# Altium schematic sheet SHDN-BSPD-S03-V00-VoltageDivider.SchDoc: Voltage Divider
size A3; DrawnBy: Jonn Dillon; DocumentNumber: 03; Revision: 01; SheetNumber: 03; SheetTotal: 12; Version: 00; PageSetup: Record=PageOptions|CenterHorizontal=True|CenterVertical=True|PrintScale=0.97|XCorrection=1.00|YCorrection=1.00|PrintKind=0|BorderSize=5000000|LeftOffset=0|BottomOffset=0|Orientation=2|PaperLength=1000|PaperWidth=1000|Scale=100|PaperSource=7|PrintQuality=-4|MediaType=1|DitherType=10|PaperKind=A4|PrintScaleMode=1
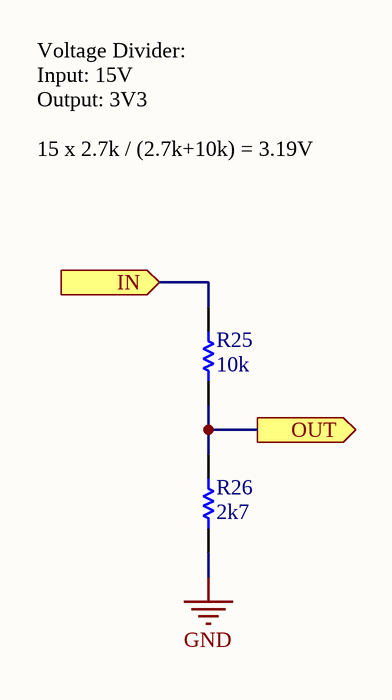
[diagram p0: SHDN-BSPD-S03-V00-VoltageDivider.SchDoc]

## Parts
R25  10k  [Res_ThinFilm_0603]
R26  2k7  [Res_ThinFilm_0603]

## Ports
IN (in), OUT (out)

## Nets
GND: R26.1
IN: R25.2 ; port IN
OUT: R25.1 R26.2 ; port OUT

## Notes on the sheet
- Voltage Divider:
  Input: 15V
  Output: 3V3
  15 x 2.7k / (2.7k+10k) = 3.19V
- Revision History:
- Sheet Title:
- Rev
- Date
- Description
- Project:
- Size:
- Drawn By:
- A3
- Number:
- Revision:
- Sheet
- Version:
- of
- QUT Motorsport
- O-120, Gardens Point
- 2 George Street
- Brisbane, QLD 4000
- Australia
- Print Date:
- Print Time:
- File Name:

## Library data of the parts
R25 = 10k 5% 0603: Resistor, SMD, 10k, 0.1W, 5%, 0603
R26 = 2k7 5% 0603: Resistor, SMD, 2k7, 0.1W, 5%, 0603